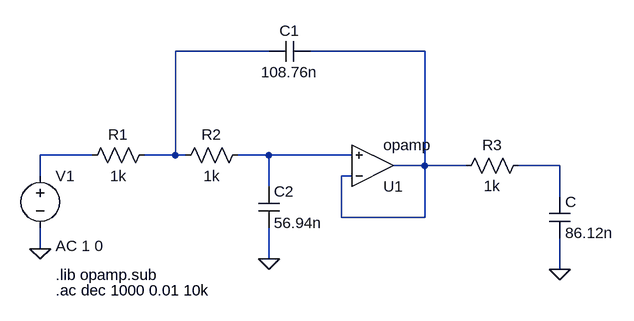
[diagram p0: schematic CircTarea3.asc]
CircTarea3.asc, the LTspice schematic file:
Version 4.1
SHEET 1 940 680
WIRE 400 -16 256 -16
WIRE 640 -16 464 -16
WIRE 128 144 48 144
WIRE 256 144 256 -16
WIRE 256 144 208 144
WIRE 272 144 256 144
WIRE 400 144 352 144
WIRE 528 144 400 144
WIRE 640 160 640 -16
WIRE 640 160 592 160
WIRE 704 160 640 160
WIRE 848 160 784 160
WIRE 48 176 48 144
WIRE 528 176 512 176
WIRE 400 192 400 144
WIRE 848 208 848 160
WIRE 512 240 512 176
WIRE 640 240 640 160
WIRE 640 240 512 240
WIRE 48 288 48 256
WIRE 400 304 400 256
WIRE 848 320 848 272
FLAG 48 288 0
FLAG 400 304 0
FLAG 848 320 0
SYMBOL voltage 48 160 R0
WINDOW 123 24 124 Left 2
WINDOW 39 0 0 Left 0
SYMATTR Value2 AC 1 0
SYMATTR InstName V1
SYMATTR Value ""
SYMBOL res 224 128 R90
WINDOW 0 0 56 VBottom 2
WINDOW 3 32 56 VTop 2
SYMATTR InstName R1
SYMATTR Value 1k
SYMBOL res 368 128 R90
WINDOW 0 0 56 VBottom 2
WINDOW 3 32 56 VTop 2
SYMATTR InstName R2
SYMATTR Value 1k
SYMBOL cap 384 192 R0
SYMATTR InstName C2
SYMATTR Value 56.94n
SYMBOL OpAmps\\opamp 560 224 M180
SYMATTR InstName U1
SYMBOL cap 464 -32 R90
WINDOW 0 0 32 VBottom 2
WINDOW 3 32 32 VTop 2
SYMATTR InstName C1
SYMATTR Value 108.76n
SYMBOL res 800 144 R90
WINDOW 0 0 56 VBottom 2
WINDOW 3 32 56 VTop 2
SYMATTR InstName R3
SYMATTR Value 1k
SYMBOL cap 832 208 R0
SYMATTR InstName C
SYMATTR Value 86.12n
TEXT 72 328 Left 2 !.lib opamp.sub
TEXT 72 352 Left 2 !.ac dec 1000 0.01 10k

The netlist it stands for:
* CircTarea3.asc
V1 N003 0 AC 1 0
R1 N001 N003 1k
R2 N004 N001 1k
C2 N004 0 56.94n
X§U1 N002 N004 N002 opamp Aol=100K GBW=10Meg  ; pins invin noninvin out
C1 N002 N001 108.76n
R3 N005 N002 1k
C N005 0 86.12n
.lib opamp.sub
.ac dec 1000 0.01 10k
.backanno
.end